# EAGLE design c1101_atmega32u4 (EAGLE 7.2.0)
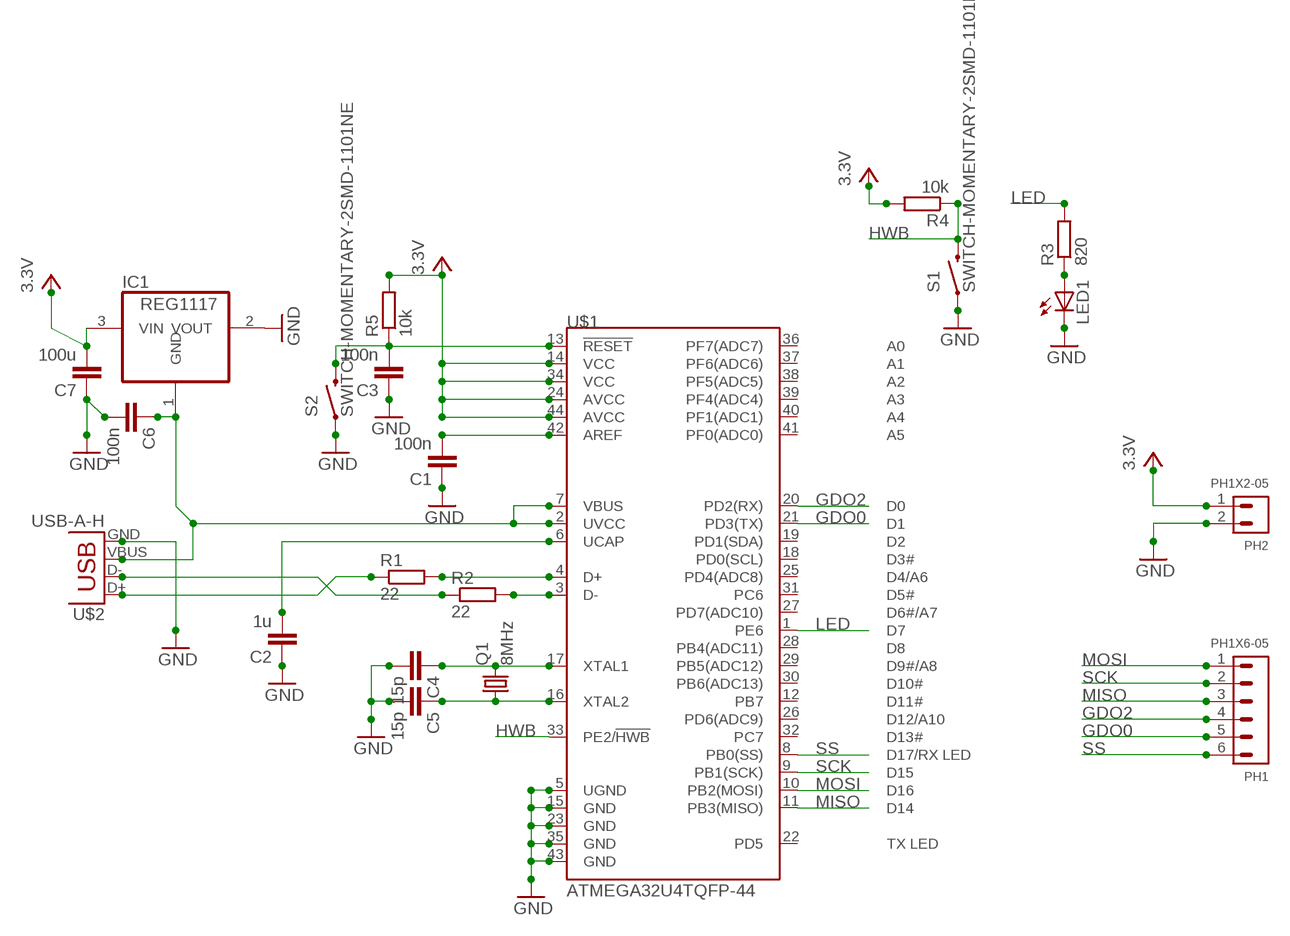
[diagram p0: schematic, sheet 1]

## Parts
C1  100n  C-EUC0805  [C0805]
C2  1u  C-EUC0805  [C0805]
C3  100n  C-EUC0805  [C0805]
C4  15p  C-EUC0805  [C0805]
C5  15p  C-EUC0805  [C0805]
C6  100n  C-EUC0805  [C0805]
C7  100u  C-EUC0805  [C0805]
IC1  REG1117  [SOT223]
LED1  LEDCHIPLED_1206  [CHIPLED_1206]
PH1  PH1X6-05  [PH005-1-6]
PH2  PH1X2-05  [PH005-1-2]
Q1  8MHz  CRYSTALHC49S  [HC49/S]
R1  22  R-EU_M0805  [M0805]
R2  22  R-EU_M0805  [M0805]
R3  820  R-EU_M0805  [M0805]
R4  10k  R-EU_M0805  [M0805]
R5  10k  R-EU_M0805  [M0805]
S1  SWITCH-MOMENTARY-2SMD-1101NE  [TACTILE-SWITCH-1101NE]
S2  SWITCH-MOMENTARY-2SMD-1101NE  [TACTILE-SWITCH-1101NE]
U$1  ATMEGA32U4TQFP-44  [TQFP44]
U$2  USB-A-H  [USB-A-H]

## Nets
GDO0: PH1.5 U$1.21(PD3(TX))
GDO2: PH1.4 U$1.20(PD2(RX))
GND: C1.1 C2.1 C3.1 C4.2 C5.2 C6.2 C7.1 IC1.2(VOUT) LED1.C PH2.2 S1.1 S2.1 U$1.5(UGND) U$1.15(GND) U$1.23(GND) U$1.35(GND) U$1.43(GND) U$2.GND
HWB: R4.1 S1.2 U$1.33(PE2/!HWB)
LED: R3.2 U$1.1(PE6)
MISO: PH1.3 U$1.11(PB3(MISO))
MOSI: PH1.1 U$1.10(PB2(MOSI))
N$1: R1.1 U$2.D+
N$2: R2.1 U$2.D-
N$4: R2.2 U$1.3(D-)
N$5: R1.2 U$1.4(D+)
N$6: C1.2 U$1.42(AREF)
N$7: C2.2 U$1.6(UCAP)
N$8: C3.2 R5.1 S2.2 U$1.13(!RESET)
N$9: C4.1 Q1.2 U$1.17(XTAL1)
N$10: C5.1 Q1.1 U$1.16(XTAL2)
N$11: LED1.A R3.1
N$12: C6.1 IC1.1(GND) U$1.2(UVCC) U$1.7(VBUS) U$2.VBUS
SCK: PH1.2 U$1.9(PB1(SCK))
SS: PH1.6 U$1.8(PB0(SS))
VCC: C7.2 IC1.3(VIN) PH2.1 R4.2 R5.2 U$1.14(VCC) U$1.24(AVCC) U$1.34(VCC) U$1.44(AVCC) ; supply symbol labelled 3.3V
Unconnected: U$1.12(PB7) U$1.18(PD0(SCL)) U$1.19(PD1(SDA)) U$1.22(PD5) U$1.25(PD4(ADC8)) U$1.26(PD6(ADC9)) U$1.27(PD7(ADC10)) U$1.28(PB4(ADC11)) U$1.29(PB5(ADC12)) U$1.30(PB6(ADC13)) U$1.31(PC6) U$1.32(PC7) U$1.36(PF7(ADC7)) U$1.37(PF6(ADC6)) U$1.38(PF5(ADC5)) U$1.39(PF4(ADC4)) U$1.40(PF1(ADC1)) U$1.41(PF0(ADC0))

## Library data of the parts
C1-C7 = resistor:C-EU: CAPACITOR, European symbol
IC1 = burr-brown:REG1117: 800mA and 1A Low Dropout (LDO) Positive Regulator 1.8V, 2.5V, 2.85V, 3.3V, 5V, and Adj; MPN: REG1117; OC_FARNELL: 1097566; OC_NEWARK: 14P6981
LED1 = adafruit:LED: LED OSRAM: - CHIPLED LG R971, LG N971, LY N971, LG Q971, LY Q971, LO R971, LY R971 LH N974, LH R974 LS Q976, LO Q976, LY Q976 LO Q996 - Hyper CHIPLED LW Q18S LB Q993, LB Q99A, LB R99A - SideLED LS A670, LO A670, LY A670, LG A670, LP A670 LB A673, LV A673, LT A673, LW A673 LH A674 LY A675 LS A676, LA A676, LO A676, LY A676, LW A676 LS A679, LY A679, LG A679 - Hyper Micro SIDELED® LS Y876, LA Y876, LO Y876, LY Y876 LT Y87S - SmartLED LW L88C, LW L88S LB L89C, LB L89S, LG L890 LS L89K, LO L89K, LY L89K LS L896, LA L896, LO L896, LY L896 - TOPLED LS T670, LO T670, LY T670, LG T670, LP T670 LSG T670, LSP T670, LSY T670, LOP T670, LYG T670 LG T671, LOG T671, LSG T671 LB T673, LV T673, LT T673, LW T673 LH T674 LS T676, LA T676, LO T676, LY T676, LB T676, LH T676, LSB T676, LW T676 LB T67C, LV T67C, LT T67C, LS T67K, LO T67K, LY T67K, LW E67C LS E67B, LA E67B, LO E67B, LY E67B, LB E67C, LV E67C, LT E67C LW T67C LS T679, LY T679, LG T679 LS T770, LO T770, LY T770, LG T770, LP T770 LB T773, LV T773, LT T773, LW T773 LH T774 LS E675, LA E675, LY E675, LS T675 LS T776, LA T776, LO T776, LY T776, LB T776 LHGB T686 LT T68C, LB T68C - Hyper Mini TOPLED® LB M676 - Mini TOPLED Santana® LG M470 LS M47K, LO M47K, LY M47K Source: http://www.osram.convergy.de/
PH1 = pel_hdr:PH1X6
PH2 = pel_hdr:PH1X2
Q1 = crystal:CRYSTAL: CRYSTAL; OC_FARNELL: 1667008; OC_NEWARK: unknown
R1-R5 = resistor:R-EU_: RESISTOR, European symbol
S1 S2 = SparkFun-Electromechanical:SWITCH-MOMENTARY-2: Various NO switches- pushbuttons, reed, etc; PROD_ID: SWCH-00815
U$1 = SparkFun-DigitalIC:ATMEGA32U4: Atmel 44-pin 8-bit Microcontroller with 32KBytes of ISP Flash and USB Controller
U$2 = SparkFun-Connectors:USB: USB Connectors USB-B-PTH is fully proven SKU : PRT-00139/CONN-08278 USB-miniB is fully proven SKU : PRT-00587 USB-A-PCB is untested. USB-A-H is throughly reviewed, but untested. Spark Fun Electronics SKU : PRT-00437 USB-B-SMT is throughly reviewed, but untested. Needs silkscreen touching up. USB-A-S has not been used/tested USB-MB-H has not been used/tested USB-MICROB has been used. CONN-09505; PROD_ID: CONN-08367

## Board
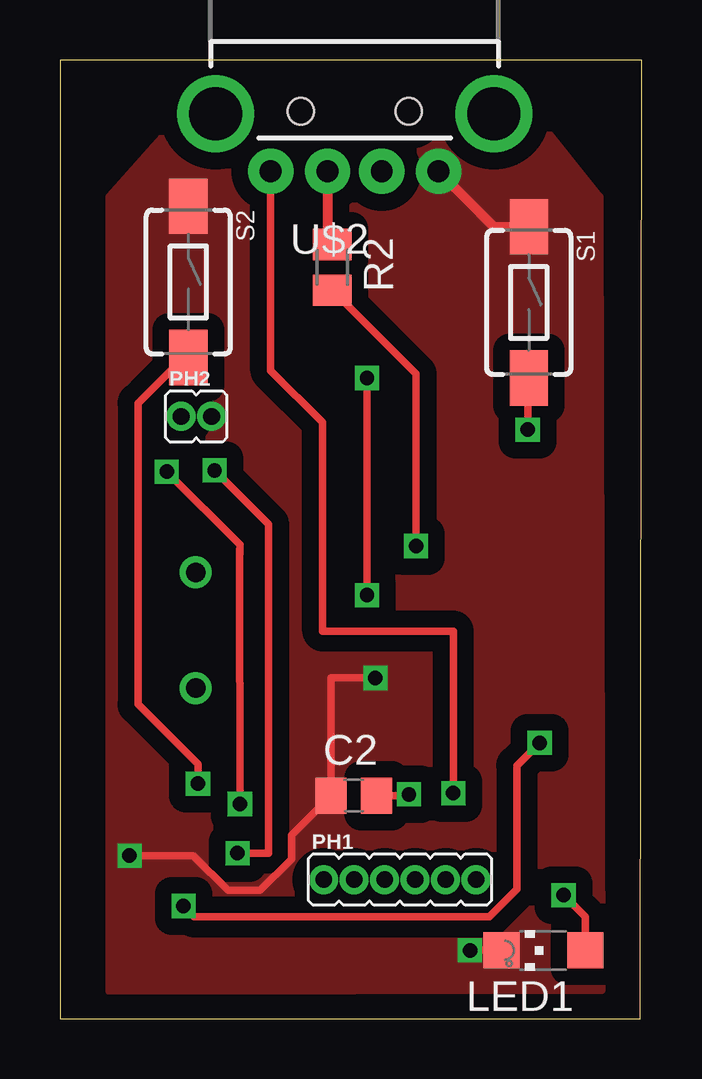
[diagram p1: board, top side]
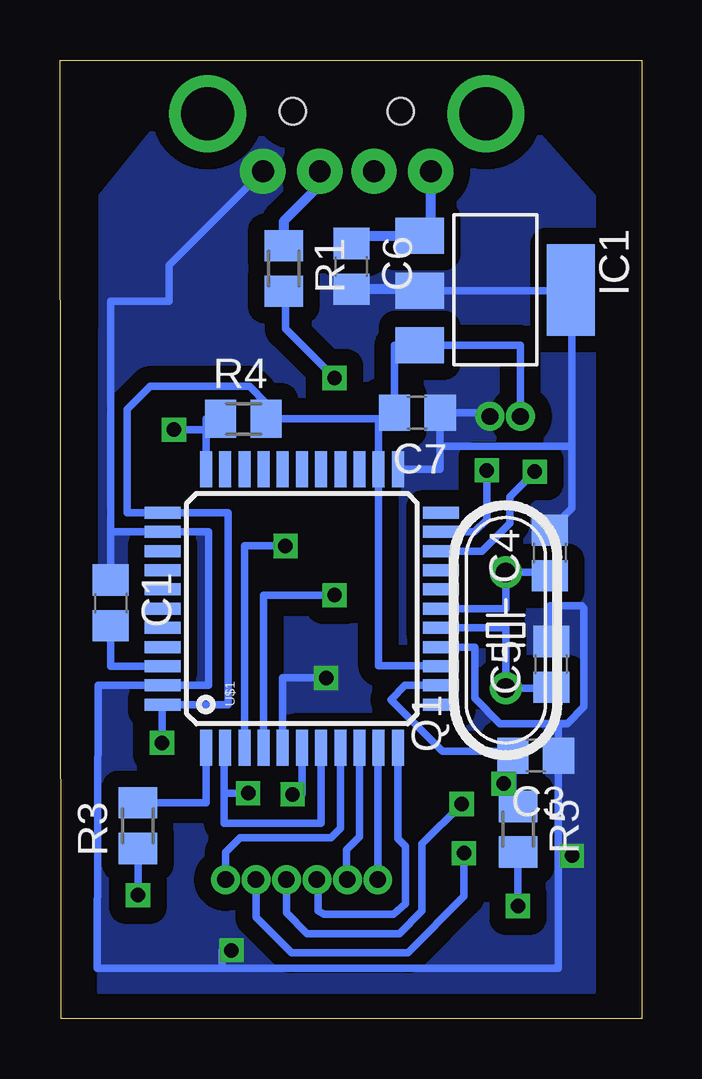
[diagram p2: board, bottom side, seen from below]

Size 24.25 x 39.95 mm. Coordinates in mm from the lower left corner, seen from the top.
Outline: 0,0 24.2,0 24.25,39.95 0,39.95 0,0
Copper layers (1*16): Top 0.035mm / dielectric 1.5mm / Bottom 0.035mm
Design rules "default": minimum track width 10mil, minimum drill 24mil, track to track 8mil, track to pad 8mil, pad to pad 8mil, via to via 8mil, smd to smd 8mil, copper to edge 40mil, drill to drill 8mil, minimum pad ring 10mil, minimum via ring 8mil, stop-mask expansion 4mil, vias tented up to drill 0mil, thermal gap 10mil

### Footprints (pad centres in the part's own frame; a part is rotated, then mirrored left to right if it is on the bottom)
C0805 = smd 1.3 x 1.5: 1 -0.95,0; 2 0.95,0
SOT223 = smd 1.499 x 2.007: 1 -2.261,-3.15; 2 0.025,-3.15; 3 2.311,-3.15 | smd 3.81 x 2.007: 4 0,3.15
CHIPLED_1206 = smd 1.5 x 1.5: A 0,-1.75; C 0,1.75
PH005-1-6 = drill 0.7 pad 1.016: 1 0,0; 2 1.27,0; 3 2.54,0; 4 3.81,0; 5 5.08,0; 6 6.35,0
PH005-1-2 = drill 0.7 pad 1.016: 1 0,0; 2 1.27,0
HC49/S = drill 0.813: 1 -2.413,0; 2 2.413,0
M0805 = smd 1.3 x 1.6: 1 -0.95,0; 2 0.95,0
TACTILE-SWITCH-1101NE = smd 2.3 x 1.6: 1 -3.15,0; 2 3.15,0
TQFP44 = smd 1.5 x 0.5: 1 -5.8,4; 2 -5.8,3.2; 3 -5.8,2.4; 4 -5.8,1.6; 5 -5.8,0.8; 6 -5.8,0; 7 -5.8,-0.8; 8 -5.8,-1.6; 9 -5.8,-2.4; 10 -5.8,-3.2; 11 -5.8,-4; 23 5.8,-4; 24 5.8,-3.2; 25 5.8,-2.4; 26 5.8,-1.6; 27 5.8,-0.8; 28 5.8,0; 29 5.8,0.8; 30 5.8,1.6; 31 5.8,2.4; 32 5.8,3.2; 33 5.8,4 | smd 0.5 x 1.5: 12 -4,-5.8; 13 -3.2,-5.8; 14 -2.4,-5.8; 15 -1.6,-5.8; 16 -0.8,-5.8; 17 0,-5.8; 18 0.8,-5.8; 19 1.6,-5.8; 20 2.4,-5.8; 21 3.2,-5.8; 22 4,-5.8; 34 4,5.8; 35 3.2,5.8; 36 2.4,5.8; 37 1.6,5.8; 38 0.8,5.8; 39 0,5.8; 40 -0.8,5.8; 41 -1.6,5.8; 42 -2.4,5.8; 43 -3.2,5.8; 44 -4,5.8
USB-A-H = drill 0.914 pad 1.88: D+ 2.4,1.127; D- 2.4,-1.127; GND 2.4,3.5; VBUS 2.4,-3.5 | drill 2.2: GND2 0,-5.8; GND3 0,5.8 | hole 1.1: -0.1,2.25; -0.1,-2.25

### Placement (x,y rotation side)
C1  22.13,17.33 270 bottom
C2  12.25,9.3 0 top
C3  4.41,10.97 180 bottom
C4  3.82,19.41 90 bottom
C5  3.77,14.77 90 bottom
C6  12.1,31.35 270 bottom
C7  9.35,25.25 180 bottom
IC1  6.1,30.37 270 bottom
LED1  20.15,2.85 90 top
PH1  11,5.8 0 top
PH2  5.05,25.1 0 top
Q1  5.66,16.19 90 bottom
R1  14.92,31.26 270 bottom
R2  11.36,31.31 270 top
R3  21,8.05 90 bottom
R4  16.6,25 0 bottom
R5  5.15,7.9 270 bottom
S1  19.55,29.85 270 top
S2  5.35,30.7 270 top
U$1  14.16,17.09 90 bottom
U$2  12.29,37.71 270 top

### Tracks (layer width: path | path; a pad name or v marks a point on that pad's centre or on a via)
GDO0  (via drill 0.6)
  Top 0.305: v6.45,22.85 8.7,20.6 8.7,6.9 v7.4,6.9
  Bottom 0.305: U$1.21 6.96,20.29 6.45,20.8 v6.45,22.85 | PH1.5 16.08,4.23 14.6,2.75 9.75,2.75 7.4,5.1 v7.4,6.9
GDO2  (via drill 0.6)
  Top 0.305: v7.5,8.95 7.5,19.09 | 7.5,19.09 7.5,19.55 7.5,19.75 v4.45,22.8 | 7.5,19.55 7.5,19.09
  Bottom 0.305: PH1.4 14.81,4.41 13.95,3.55 10.1,3.55 9.15,4.5 9.15,7.3 v7.5,8.95 | U$1.20 6.66,19.49 5.5,20.65 5.5,21.75 v4.45,22.8
GND  (via drill 0.6)
  Top 0.305: v13.15,14.2 11.3,14.2 C2.1 9.65,7.65 9.65,6.65 8.35,5.35 7,5.35 5.55,6.8 v2.9,6.8 | LED1.C v17.1,2.85
  Top 0.406: U$2.GND 18.1,33 S1.1
  Bottom 0.305: C5.2 3.82,15.77 3.82,17.2 2.5,17.2 2.4,17.1 2.4,13 3.1,12.3 3.46,12.3 | U$1.15 6.95,15.49 6.95,13.35 5.9,12.3 3.46,12.3 | 22.13,20.29 U$1.35 18.05,20.3 18.05,13.89 U$1.43 22.65,13.89 22.7,2.1 17.5,2.1 | 22.13,20.29 C1.1 | 3.46,12.3 C3.1 3.46,7 | 3.46,7 3.46,2.1 17.5,2.1 | C7.1 8.4,23.85 | 8.4,23.85 8.4,22.89 U$1.23 | IC1.2 2.9,30.34 2.9,23.85 | 2.9,23.85 2.9,21.28 C4.2 | C7.1 8.4,24.85 | U$1.5 14.96,14.2 v13.15,14.2 | 22.13,20.29 22.13,29.9 19.7,29.9 19.7,31.4 U$2.GND | PH2.2 6.32,25.25 C7.1 | 8.4,23.85 2.9,23.85 | v17.1,2.85 17.5,2.85 17.5,2.1 | v2.9,6.8 3.26,6.8 3.46,7
  Bottom 0.406: IC1.2 9.31,30.4 C6.2
  pour Bottom (isolate 0.7, no thermals): 22.55,1.15 2.05,1.15 2.05,34.25 6.55,39.3 18.55,39.2 22.5,34.3
  pour Top (isolate 0.7, no thermals): 2.05,1.15 22.6,1.2 22.5,34.25 18.5,39.25 6.5,39.25 2.05,34.25
HWB  (via drill 0.6)
  Top 0.305: v19.5,24.55 19.5,26.7 S1.2
  Bottom 0.305: R4.1 18.16,25 18.16,24.55 | 18.16,24.55 U$1.33 | 18.16,24.55 v19.5,24.55
LED
  Bottom 0.305: U$1.1 18.16,9 R3.2
MISO
  Bottom 0.305: U$1.11 10.16,7.51 9.85,7.2 9.85,4.8 10.35,4.35 13.25,4.35 13.5,4.5 13.5,5.76 PH1.3
MOSI
  Bottom 0.305: U$1.10 11,11.25 PH1.1
N$1
  Bottom 0.406: U$2.D+ 13.42,34.73 14.92,33.23 R1.1
N$2
  Top 0.406: U$2.D- 11.16,32.46 R2.1
N$4  (via drill 0.6)
  Top 0.305: R2.2 14.85,26.87 v14.85,19.7
  Bottom 0.305: U$1.3 16.56,19.7 v14.85,19.7
N$5  (via drill 0.6)
  Top 0.305: v12.8,17.65 v12.8,26.7
  Bottom 0.305: U$1.4 15.76,17.65 v12.8,17.65 | R1.2 14.85,30.24 14.85,28.75 v12.8,26.7 12.85,26.7
N$6
  Bottom 0.305: C1.2 22.13,14.69 U$1.42
N$7  (via drill 0.6)
  Top 0.305: v14.55,9.35 14.55,9.3 C2.2
  Bottom 0.305: 14.2,9.35 v14.55,9.35 14.16,9.35 U$1.6
N$8  (via drill 0.6)
  Top 0.305: S2.2 5.15,27.55 3.25,25.65 3.25,13.1 5.75,10.6 v5.75,9.8
  Bottom 0.305: U$1.13 9.86,13.89 10.45,13.3 8.3,11.15 5.54,11.15 arc90 C3.2 5.36,9.75 | 5.36,9.75 5.36,9.06 arc-90 R5.1 | v5.75,9.8 5.7,9.75 5.36,9.75
N$9
  Bottom 0.305: U$1.17 5.66,17.09 Q1.2 3.96,18.6 C4.1
N$10
  Bottom 0.305: U$1.16 5.66,16.29 Q1.1 3.77,13.78 C5.1
N$11  (via drill 0.6)
  Top 0.305: v21,5.15 21.9,4.25 LED1.A
  Bottom 0.305: R3.1 v21,5.15
N$12  (via drill 0.6)
  Top 0.305: v16.4,9.4 16.4,16.15 10.95,16.15 10.95,24.85 8.79,27.01 U$2.VBUS 8.79,34.49
  Bottom 0.305: 13.4,11.29 U$1.7 13.36,8.15 17.4,8.15 17.4,9.4 | 17.4,9.4 17.4,11.29 U$1.2 | 17.4,9.4 v16.4,9.4
  Bottom 0.406: C6.1 11.77,32.63 IC1.1 8.79,33.09 U$2.VBUS
SCK
  Bottom 0.305: U$1.9 11.76,7.59 12.3,7.05 12.3,5.83 PH1.2
SS
  Bottom 0.305: U$1.8 12.56,7.94 12.95,7.55 16.75,7.55 17.35,6.95 PH1.6
VCC  (via drill 0.6)
  Top 0.305: v20,11.5 19.05,10.55 19.05,5.4 17.9,4.25 5.6,4.25 v5.15,4.7
  Bottom 0.305: U$1.14 8.5,14.69 8.5,14.7 10.96,14.7 U$1.24 10.96,25 | 10.96,25 R4.2 15.65,25.65 16.35,26.35 20.5,26.35 21.45,25.4 21.45,21.09 U$1.34 17.25,21.09 17.25,13.09 U$1.44 20,13.09 v20,11.5 | 10.96,25 10.3,25 C7.2 10.3,28.06 IC1.3 5.05,28.06 PH2.1 | R5.2 v5.15,4.7